# EAGLE design ADCDAC (EAGLE 5.07)
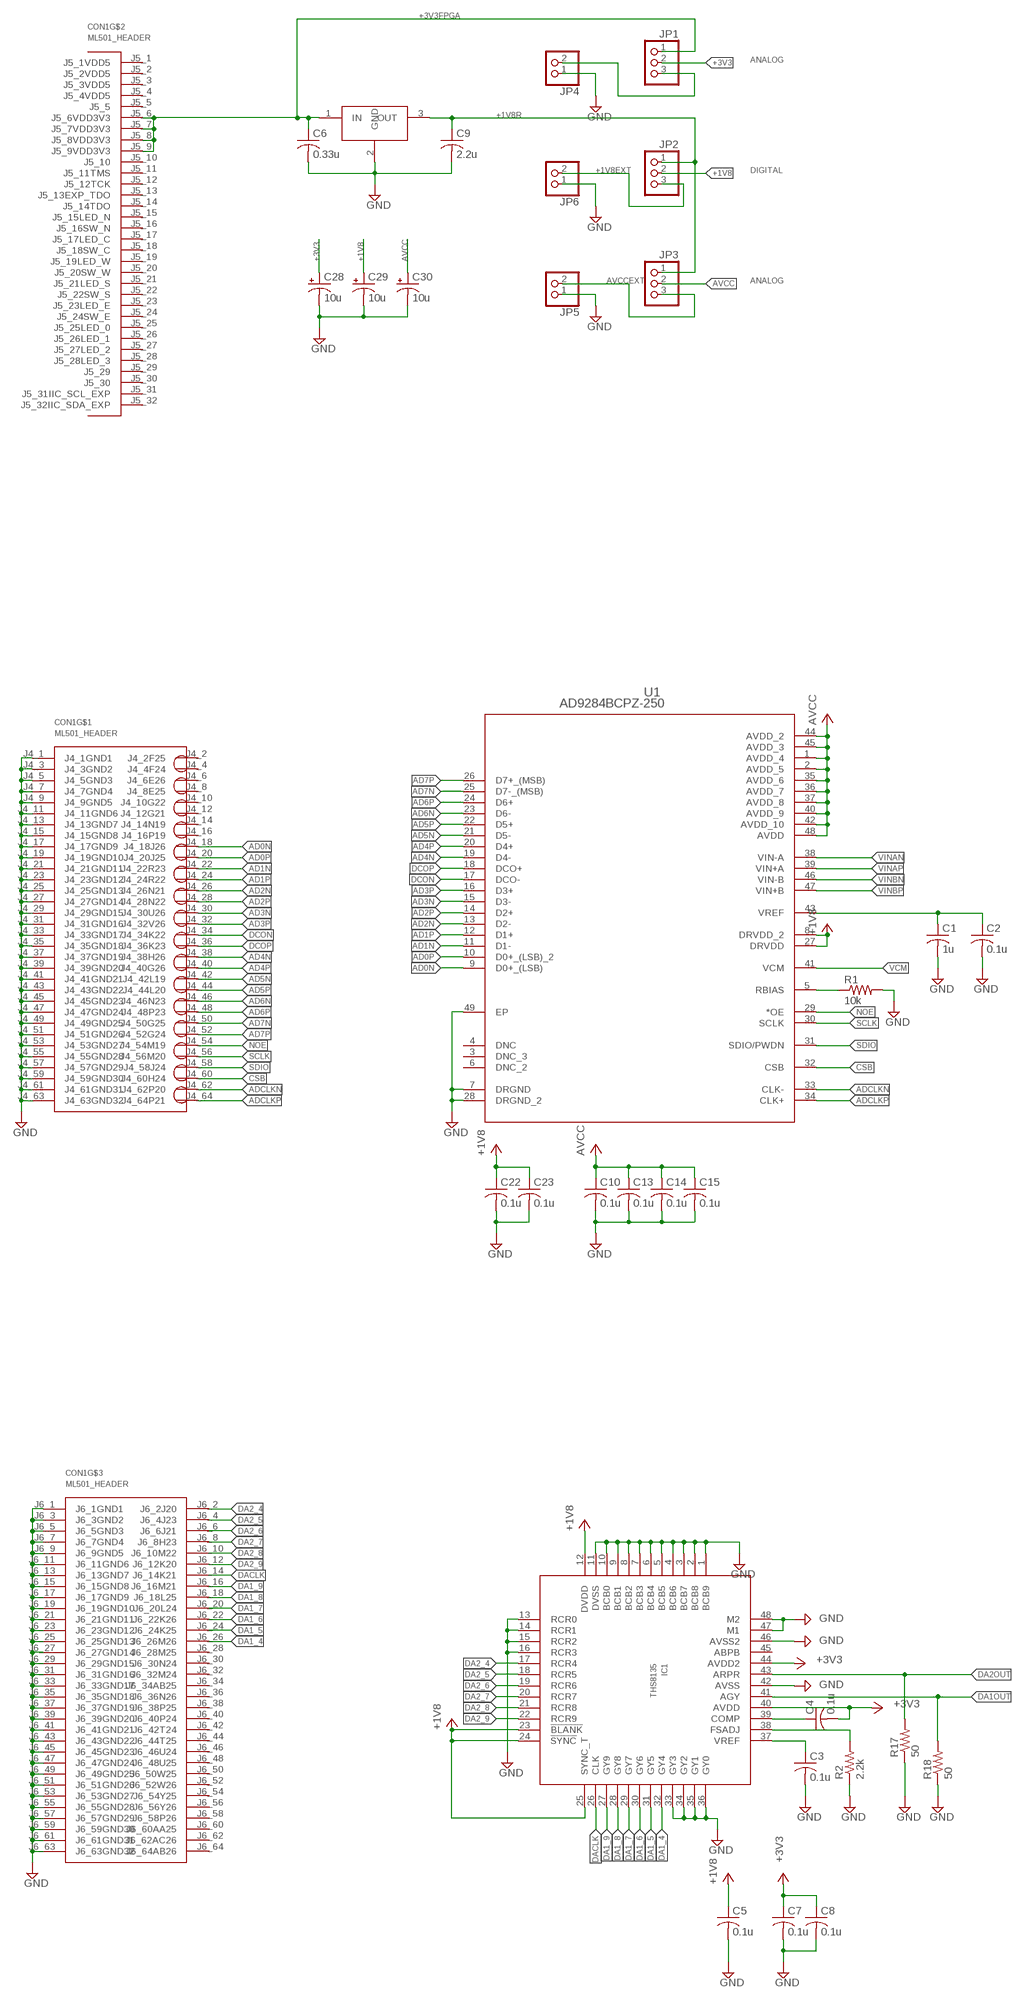
[diagram p0: schematic, sheet 1, part 1 of 2]
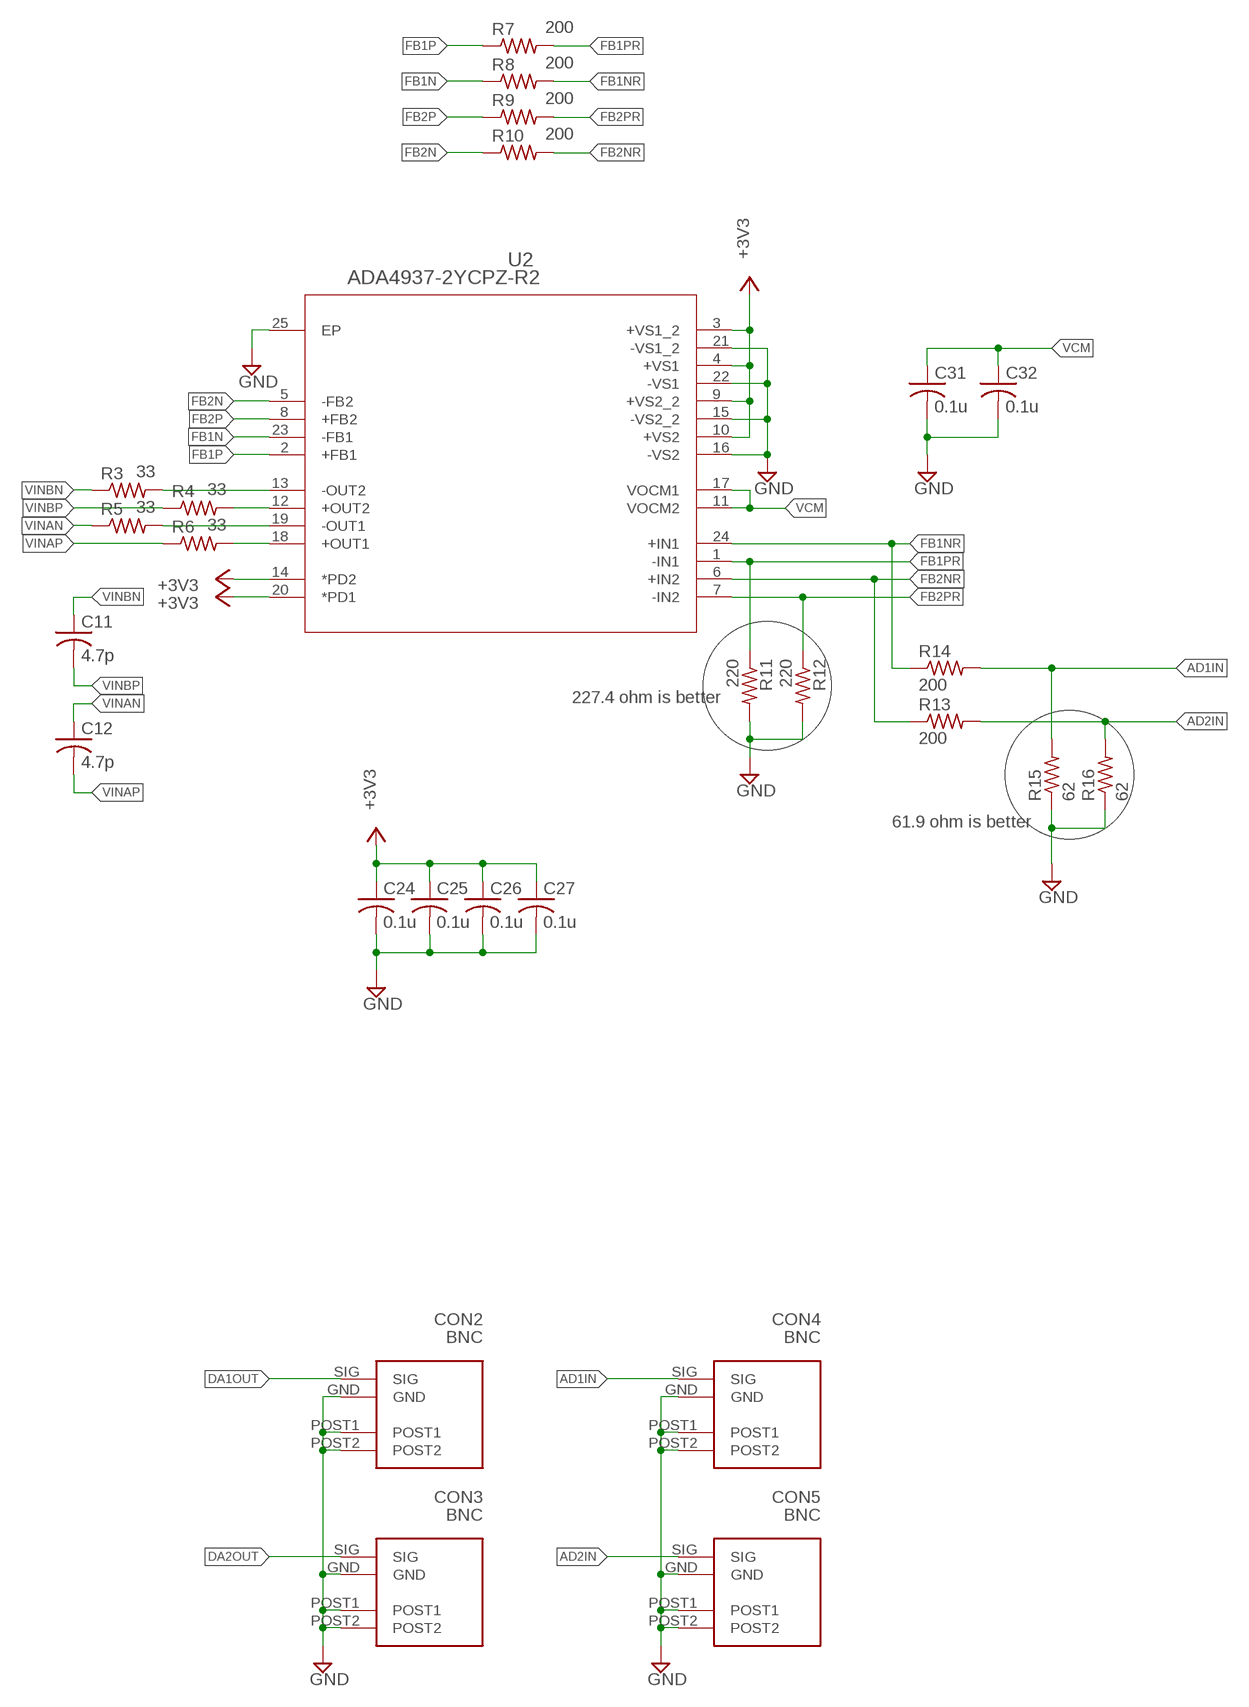
[diagram p1: schematic, sheet 1, part 2 of 2]

## Parts
C1  1u  C-3216  [3216]
C2  0.1u  C-2012  [2012-C]
C3  0.1u  C-2012  [2012-C]
C4  0.1u  C-2012  [2012-C]
C5  0.1u  C-2012  [2012-C]
C6  0.33u  C-2012  [2012-C]
C7  0.1u  C-2012  [2012-C]
C8  0.1u  C-2012  [2012-C]
C9  2.2u  C-3216  [3216]
C10  0.1u  C-2012  [2012-C]
C11  4.7p  C-1608  [1608]
C12  4.7p  C-1608  [1608]
C13  0.1u  C-2012  [2012-C]
C14  0.1u  C-2012  [2012-C]
C15  0.1u  C-2012  [2012-C]
C22  0.1u  C-2012  [2012-C]
C23  0.1u  C-2012  [2012-C]
C24  0.1u  C-2012  [2012-C]
C25  0.1u  C-2012  [2012-C]
C26  0.1u  C-2012  [2012-C]
C27  0.1u  C-2012  [2012-C]
C28  10u  CC-5-5  [E5-5]
C29  10u  CC-5-5  [E5-5]
C30  10u  CC-5-5  [E5-5]
C31  0.1u  C-2012  [2012-C]
C32  0.1u  C-2012  [2012-C]
CON1  ML501_HEADER  [ML501_HEADER]
CON2  BNC  [BNC1-1337542-0]
CON3  BNC  [BNC1-1337542-0]
CON4  BNC  [BNC1-1337542-0]
CON5  BNC  [BNC1-1337542-0]
IC1  THS8135  [LQFP48]
IC3  NJM2845DL1-18  [TO-252-3]
JP1  PINHD-1X3  [1X03]
JP2  PINHD-1X3  [1X03]
JP3  PINHD-1X3  [1X03]
JP4  PINHD-1X2  [1X02]
JP5  PINHD-1X2  [1X02]
JP6  PINHD-1X2  [1X02]
R1  10k  R-1608  [1608]
R2  2.2k  R-1608  [1608]
R3  33  R-1608  [1608]
R4  33  R-1608  [1608]
R5  33  R-1608  [1608]
R6  33  R-1608  [1608]
R7  200  R-1608  [1608]
R8  200  R-1608  [1608]
R9  200  R-1608  [1608]
R10  200  R-1608  [1608]
R11  220  R-1608  [1608]
R12  220  R-1608  [1608]
R13  200  R-1608  [1608]
R14  200  R-1608  [1608]
R15  62  R-1608  [1608]
R16  62  R-1608  [1608]
R17  50  R-1608  [1608]
R18  50  R-1608  [1608]
U1  AD9284BCPZ-250  [CP_48_12]
U2  ADA4937-2YCPZ-R2  [CP_24_1]

## Nets
+1V8: C5.1 C22.1 C23.1 C29.+ IC1.12(DVDD) IC1.23(!BLANK) IC1.24(!SYNC) IC1.25(SYNC_T) JP2.2 U1.8(DRVDD_2) U1.27(DRVDD)
+1V8EXT: JP2.3 JP6.2
+1V8R: C9.1 IC3.3(OUT) JP2.1 JP3.1
+3V3: C4.2 C7.1 C8.1 C24.1 C25.1 C26.1 C27.1 C28.+ IC1.40(AVDD) IC1.44(AVDD2) JP1.2 U2.3(+VS1_2) U2.4(+VS1) U2.9(+VS2_2) U2.10(+VS2) U2.14(*PD2) U2.20(*PD1)
+3V3FPGA: C6.1 CON1.J5_6(J5_6VDD3V3) CON1.J5_7(J5_7VDD3V3) CON1.J5_8(J5_8VDD3V3) CON1.J5_9(J5_9VDD3V3) IC3.1(IN) JP1.1
AD0N: CON1.J4_18(J4_18J26) U1.9(D0+_(LSB))
AD0P: CON1.J4_20(J4_20J25) U1.10(D0+_(LSB)_2)
AD1IN: CON4.SIG R14.2 R15.2
AD1N: CON1.J4_22(J4_22R23) U1.11(D1-)
AD1P: CON1.J4_24(J4_24R22) U1.12(D1+)
AD2IN: CON5.SIG R13.2 R16.2
AD2N: CON1.J4_26(J4_26N21) U1.13(D2-)
AD2P: CON1.J4_28(J4_28N22) U1.14(D2+)
AD3N: CON1.J4_30(J4_30U26) U1.15(D3-)
AD3P: CON1.J4_32(J4_32V26) U1.16(D3+)
AD4N: CON1.J4_38(J4_38H26) U1.19(D4-)
AD4P: CON1.J4_40(J4_40G26) U1.20(D4+)
AD5N: CON1.J4_42(J4_42L19) U1.21(D5-)
AD5P: CON1.J4_44(J4_44L20) U1.22(D5+)
AD6N: CON1.J4_46(J4_46N23) U1.23(D6-)
AD6P: CON1.J4_48(J4_48P23) U1.24(D6+)
AD7N: CON1.J4_50(J4_50G25) U1.25(D7-_(MSB))
AD7P: CON1.J4_52(J4_52G24) U1.26(D7+_(MSB))
ADCLKN: CON1.J4_62(J4_62P20) U1.33(CLK-)
ADCLKP: CON1.J4_64(J4_64P21) U1.34(CLK+)
AVCC: C10.1 C13.1 C14.1 C15.1 C30.+ JP3.2 U1.1(AVDD_4) U1.2(AVDD_5) U1.35(AVDD_6) U1.36(AVDD_7) U1.37(AVDD_8) U1.40(AVDD_9) U1.42(AVDD_10) U1.44(AVDD_2) U1.45(AVDD_3) U1.48(AVDD)
AVCCEXT: JP3.3 JP5.2
CSB: CON1.J4_60(J4_60H24) U1.32(CSB)
DA1_4: CON1.J6_26(J6_26M26) IC1.32(GY4)
DA1_5: CON1.J6_24(J6_24K25) IC1.31(GY5)
DA1_6: CON1.J6_22(J6_22K26) IC1.30(GY6)
DA1_7: CON1.J6_20(J6_20L24) IC1.29(GY7)
DA1_8: CON1.J6_18(J6_18L25) IC1.28(GY8)
DA1_9: CON1.J6_16(J6_16M21) IC1.27(GY9)
DA1OUT: CON2.SIG IC1.41(AGY) R18.2
DA2_4: CON1.J6_2(J6_2J20) IC1.17(RCR4)
DA2_5: CON1.J6_4(J6_4J23) IC1.18(RCR5)
DA2_6: CON1.J6_6(J6_6J21) IC1.19(RCR6)
DA2_7: CON1.J6_8(J6_8H23) IC1.20(RCR7)
DA2_8: CON1.J6_10(J6_10M22) IC1.21(RCR8)
DA2_9: CON1.J6_12(J6_12K20) IC1.22(RCR9)
DA2OUT: CON3.SIG IC1.43(ARPR) R17.2
DACLK: CON1.J6_14(J6_14K21) IC1.26(CLK)
DCON: CON1.J4_34(J4_34K22) U1.17(DCO-)
DCOP: CON1.J4_36(J4_36K23) U1.18(DCO+)
FB1N: R8.1 U2.23(-FB1)
FB1NR: R8.2 R14.1 U2.24(+IN1)
FB1P: R7.1 U2.2(+FB1)
FB1PR: R7.2 R11.1 U2.1(-IN1)
FB2N: R10.1 U2.5(-FB2)
FB2NR: R10.2 R13.1 U2.6(+IN2)
FB2P: R9.1 U2.8(+FB2)
FB2PR: R9.2 R12.1 U2.7(-IN2)
GND: C1.2 C2.2 C3.2 C5.2 C6.2 C7.2 C8.2 C9.2 C10.2 C13.2 C14.2 C15.2 C22.2 C23.2 C24.2 C25.2 C26.2 C27.2 C28.- C29.- C30.- C31.2 C32.2 CON1.J4_1(J4_1GND1) CON1.J4_3(J4_3GND2) CON1.J4_5(J4_5GND3) CON1.J4_7(J4_7GND4) CON1.J4_9(J4_9GND5) CON1.J4_11(J4_11GND6) CON1.J4_13(J4_13GND7) CON1.J4_15(J4_15GND8) CON1.J4_17(J4_17GND9) CON1.J4_19(J4_19GND10) CON1.J4_21(J4_21GND11) CON1.J4_23(J4_23GND12) CON1.J4_25(J4_25GND13) CON1.J4_27(J4_27GND14) CON1.J4_29(J4_29GND15) CON1.J4_31(J4_31GND16) CON1.J4_33(J4_33GND17) CON1.J4_35(J4_35GND18) CON1.J4_37(J4_37GND19) CON1.J4_39(J4_39GND20) CON1.J4_41(J4_41GND21) CON1.J4_43(J4_43GND22) CON1.J4_45(J4_45GND23) CON1.J4_47(J4_47GND24) CON1.J4_49(J4_49GND25) CON1.J4_51(J4_51GND26) CON1.J4_53(J4_53GND27) CON1.J4_55(J4_55GND28) CON1.J4_57(J4_57GND29) CON1.J4_59(J4_59GND30) CON1.J4_61(J4_61GND31) CON1.J4_63(J4_63GND32) CON1.J6_1(J6_1GND1) CON1.J6_3(J6_3GND2) CON1.J6_5(J6_5GND3) CON1.J6_7(J6_7GND4) CON1.J6_9(J6_9GND5) CON1.J6_11(J6_11GND6) CON1.J6_13(J6_13GND7) CON1.J6_15(J6_15GND8) CON1.J6_17(J6_17GND9) CON1.J6_19(J6_19GND10) CON1.J6_21(J6_21GND11) CON1.J6_23(J6_23GND12) CON1.J6_25(J6_25GND13) CON1.J6_27(J6_27GND14) CON1.J6_29(J6_29GND15) CON1.J6_31(J6_31GND16) CON1.J6_33(J6_33GND17) CON1.J6_35(J6_35GND18) CON1.J6_37(J6_37GND19) CON1.J6_39(J6_39GND20) CON1.J6_41(J6_41GND21) CON1.J6_43(J6_43GND22) CON1.J6_45(J6_45GND23) CON1.J6_47(J6_47GND24) CON1.J6_49(J6_49GND25) CON1.J6_51(J6_51GND26) CON1.J6_53(J6_53GND27) CON1.J6_55(J6_55GND28) CON1.J6_57(J6_57GND29) CON1.J6_59(J6_59GND30) CON1.J6_61(J6_61GND31) CON1.J6_63(J6_63GND32) CON2.GND CON2.POST1 CON2.POST2 CON3.GND CON3.POST1 CON3.POST2 CON4.GND CON4.POST1 CON4.POST2 CON5.GND CON5.POST1 CON5.POST2 IC1.1(BCB9) IC1.2(BCB8) IC1.3(BCB7) IC1.4(BCB6) IC1.5(BCB5) IC1.6(BCB4) IC1.7(BCB3) IC1.8(BCB2) IC1.9(BCB1) IC1.10(BCB0) IC1.11(DVSS) IC1.13(RCR0) IC1.14(RCR1) IC1.15(RCR2) IC1.16(RCR3) IC1.33(GY3) IC1.34(GY2) IC1.35(GY1) IC1.36(GY0) IC1.42(AVSS) IC1.46(AVSS2) IC1.47(M1) IC1.48(M2) IC3.2(GND) JP4.1 JP5.1 JP6.1 R1.2 R2.1 R11.2 R12.2 R15.1 R16.1 R17.1 R18.1 U1.7(DRGND) U1.28(DRGND_2) U1.49(EP) U2.15(-VS2_2) U2.16(-VS2) U2.21(-VS1_2) U2.22(-VS1) U2.25(EP)
N$1: R1.1 U1.5(RBIAS)
N$2: C1.1 C2.1 U1.43(VREF)
N$3: C3.1 IC1.37(VREF)
N$4: IC1.38(FSADJ) R2.2
N$5: C4.1 IC1.39(COMP)
N$6: R3.2 U2.13(-OUT2)
N$8: JP1.3 JP4.2
N$9: R4.2 U2.12(+OUT2)
N$10: R5.2 U2.19(-OUT1)
N$11: R6.2 U2.18(+OUT1)
NOE: CON1.J4_54(J4_54M19) U1.29(*OE)
SCLK: CON1.J4_56(J4_56M20) U1.30(SCLK)
SDIO: CON1.J4_58(J4_58J24) U1.31(SDIO/PWDN)
VCM: C31.1 C32.1 U1.41(VCM) U2.11(VOCM2) U2.17(VOCM1)
VINAN: C12.1 R5.1 U1.38(VIN-A)
VINAP: C12.2 R6.1 U1.39(VIN+A)
VINBN: C11.1 R3.1 U1.46(VIN-B)
VINBP: C11.2 R4.1 U1.47(VIN+B)
Unconnected: CON1.J4_2(J4_2F25) CON1.J4_4(J4_4F24) CON1.J4_6(J4_6E26) CON1.J4_8(J4_8E25) CON1.J4_10(J4_10G22) CON1.J4_12(J4_12G21) CON1.J4_14(J4_14N19) CON1.J4_16(J4_16P19) CON1.J5_1(J5_1VDD5) CON1.J5_2(J5_2VDD5) CON1.J5_3(J5_3VDD5) CON1.J5_4(J5_4VDD5) CON1.J5_5 CON1.J5_10 CON1.J5_11(J5_11TMS) CON1.J5_12(J5_12TCK) CON1.J5_13(J5_13EXP_TDO) CON1.J5_14(J5_14TDO) CON1.J5_15(J5_15LED_N) CON1.J5_16(J5_16SW_N) CON1.J5_17(J5_17LED_C) CON1.J5_18(J5_18SW_C) CON1.J5_19(J5_19LED_W) CON1.J5_20(J5_20SW_W) CON1.J5_21(J5_21LED_S) CON1.J5_22(J5_22SW_S) CON1.J5_23(J5_23LED_E) CON1.J5_24(J5_24SW_E) CON1.J5_25(J5_25LED_0) CON1.J5_26(J5_26LED_1) CON1.J5_27(J5_27LED_2) CON1.J5_28(J5_28LED_3) CON1.J5_29 CON1.J5_30 CON1.J5_31(J5_31IIC_SCL_EXP) CON1.J5_32(J5_32IIC_SDA_EXP) CON1.J6_28(J6_28M25) CON1.J6_30(J6_30N24) CON1.J6_32(J6_32M24) CON1.J6_34(J6_34AB25) CON1.J6_36(J6_36N26) CON1.J6_38(J6_38P25) CON1.J6_40(J6_40P24) CON1.J6_42(J6_42T24) CON1.J6_44(J6_44T25) CON1.J6_46(J6_46U24) CON1.J6_48(J6_48U25) CON1.J6_50(J6_50W25) CON1.J6_52(J6_52W26) CON1.J6_54(J6_54Y25) CON1.J6_56(J6_56Y26) CON1.J6_58(J6_58P26) CON1.J6_60(J6_60AA25) CON1.J6_62(J6_62AC26) CON1.J6_64(J6_64AB26) CON1.J7_1(J7_1VDD2V5) CON1.J7_2(J7_2VDD2V5) CON1.J7_3(J7_3VDD2V5) CON1.J7_4(J7_4VDD2V5) CON1.J7_5(J7_5VDD2V5) CON1.J7_6(J7_6VDD2V5) CON1.J7_7(J7_7VDD2V5) CON1.J7_8(J7_8VDD2V5) CON1.J7_9(J7_9VDD2V5) CON1.J7_10(J7_10VDD2V5) CON1.J7_11(J7_11VDD2V5) CON1.J7_12(J7_12VDD2V5) CON1.J7_13(J7_13VDD2V5) CON1.J7_14(J7_14VDD2V5) CON1.J7_15(J7_15VDD2V5) CON1.J7_16(J7_16VDD2V5) CON1.J7_17(J7_17VDD2V5) CON1.J7_18(J7_18VDD2V5) CON1.J7_19(J7_19VDD2V5) CON1.J7_20(J7_20VDD2V5) CON1.J7_21(J7_21VDD2V5) CON1.J7_22(J7_22VDD2V5) CON1.J7_23(J7_23VDD2V5) CON1.J7_24(J7_24VDD2V5) CON1.J7_25(J7_25VDD2V5) CON1.J7_26(J7_26VDD2V5) CON1.J7_27(J7_27VDD2V5) CON1.J7_28(J7_28VDD2V5) CON1.J7_29(J7_29VDD2V5) CON1.J7_30(J7_30VDD2V5) CON1.J7_31(J7_31VDD2V5) CON1.J7_32(J7_32VDD2V5) IC1.45(ABPB) U1.3(DNC_3) U1.4(DNC) U1.6(DNC_2)

## Notes on the sheet
- ANALOG
- DIGITAL
- ANALOG
- 227.4 ohm is better
- 61.9 ohm is better

## Library data of the parts
C1-C15 C22-C27 C31 C32 = Passive_Robotech:C
C28-C30 = Passive_Robotech:CC
CON1 = vdec:ML501_HEADER
CON2-CON5 = vdec:BNC
IC1 = vdec:THS8135
IC3 = IC_Robotech:NJM2845DL1-*
JP1-JP3 = pinhead:PINHD-1X3: PIN HEADER
JP4-JP6 = pinhead:PINHD-1X2: PIN HEADER
R1-R18 = Passive_Robotech:R
U1 = vdec:AD9284BCPZ-250
U2 = vdec:ADA4937-2YCPZ-R2

## Board
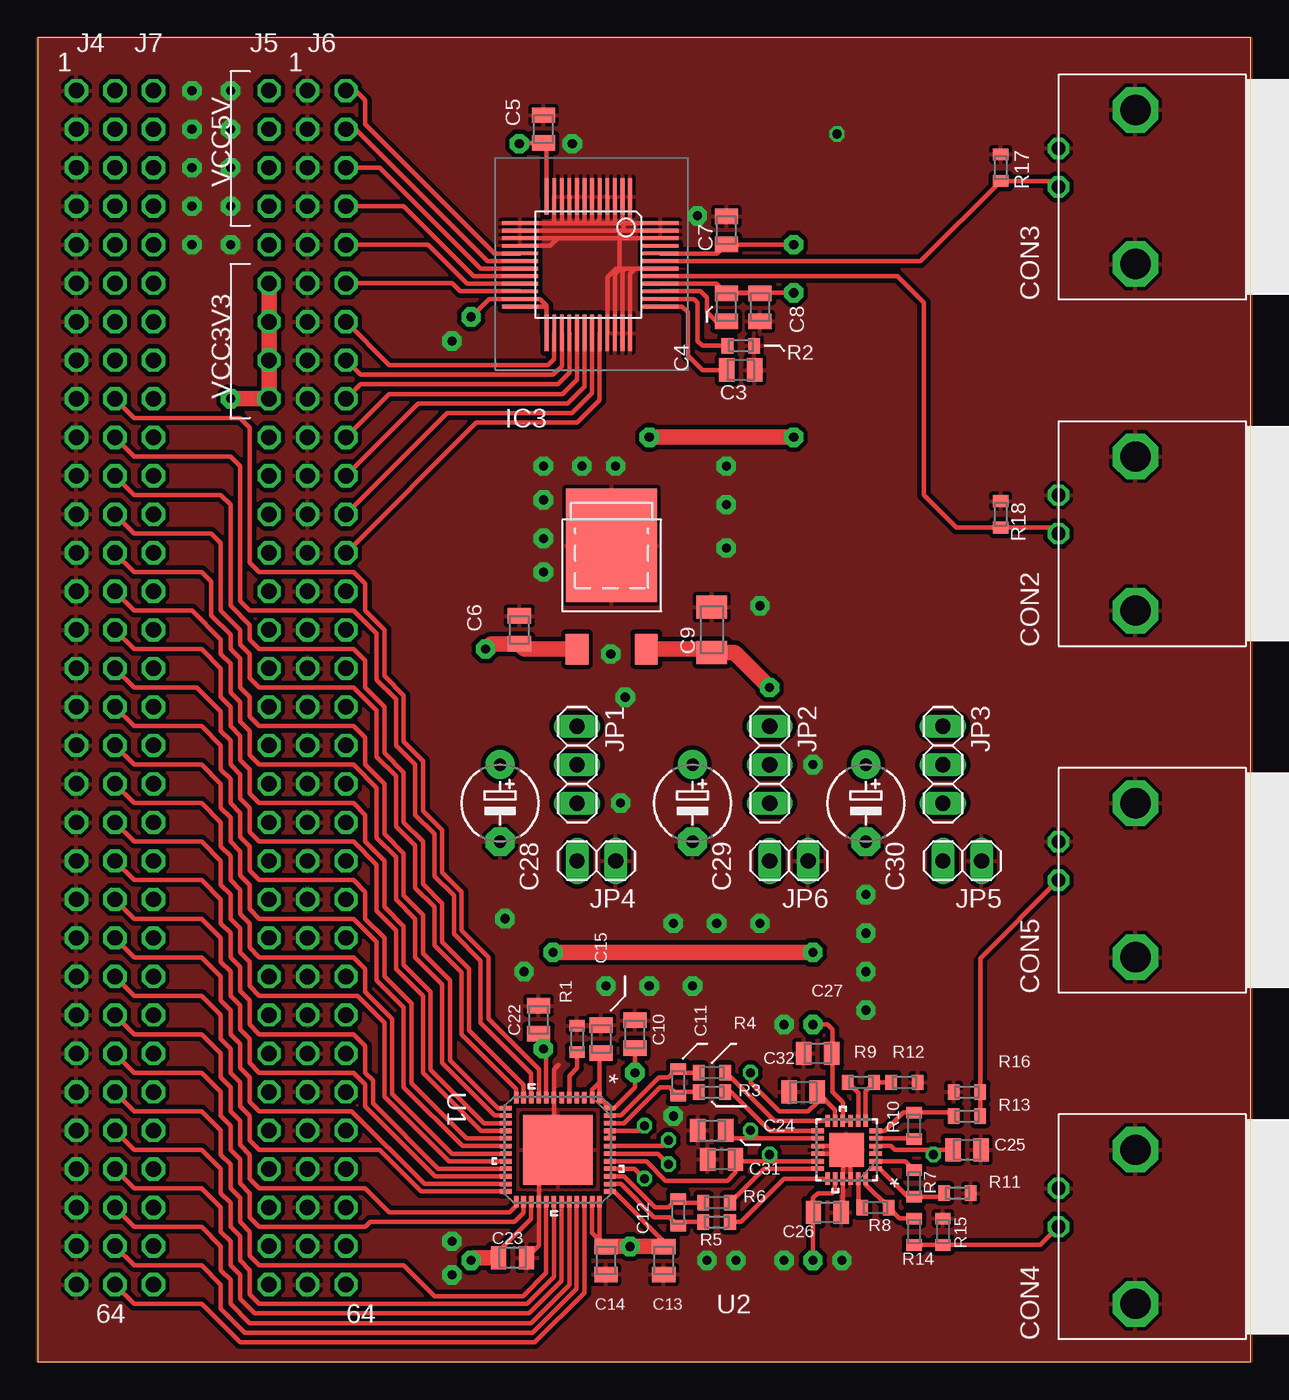
[diagram p2: board, top side]
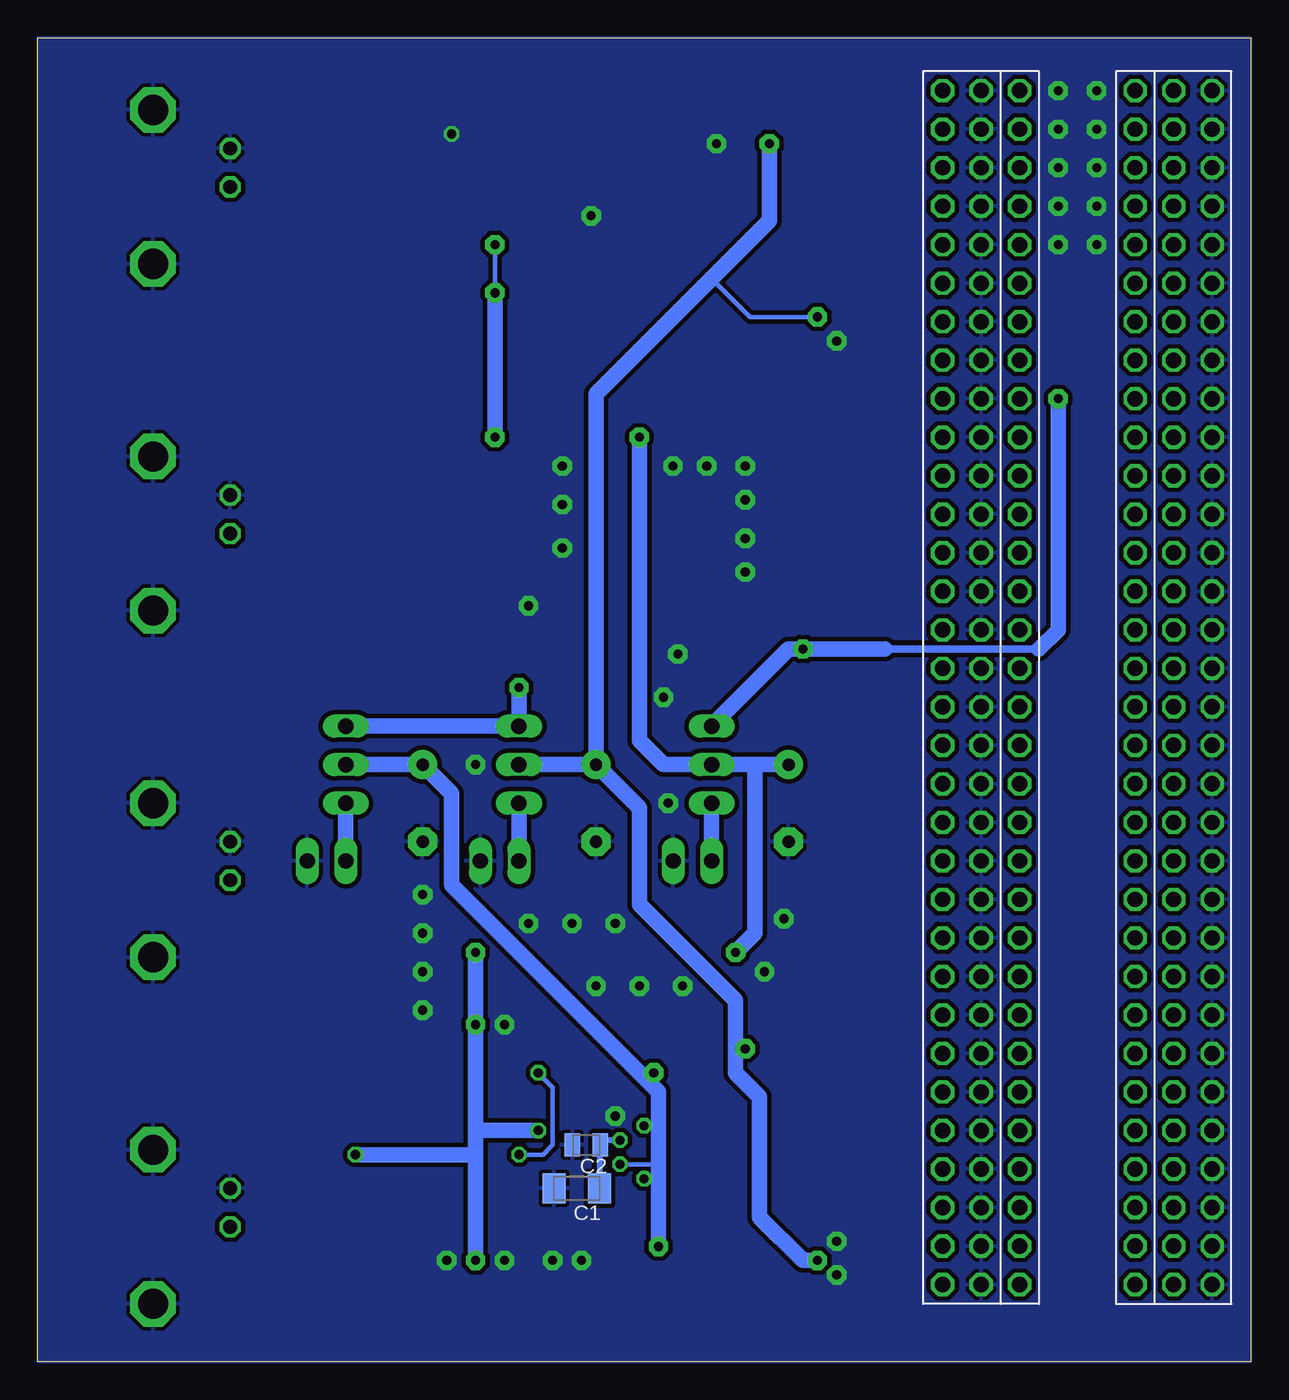
[diagram p3: board, bottom side, seen from below]

Size 79.99 x 87.3 mm. Coordinates in mm from the lower left corner, seen from the top.
Outline: 0,0 79.99,0 79.99,87.3 0,87.3 0,0
Copper layers (1*16): Top 0.0356mm / dielectric 1.5011mm / Bottom 0.0356mm
Design rules "formitaminimum": minimum track width 5mil, minimum drill 0.5994mm, track to track 0.2007mm, track to pad 0.2007mm, pad to pad 0.2007mm, via to via 0.2007mm, smd to smd 0mil, copper to edge 0mil, drill to drill 1mil, minimum pad ring 10mil, minimum via ring 8mil, stop-mask expansion 4mil, vias tented up to drill 0mil, thermal gap 10mil

### Footprints (pad centres in the part's own frame; a part is rotated, then mirrored left to right if it is on the bottom)
3216 = smd 1.5 x 2: 1 -1.5,0; 2 1.5,0
2012-C = smd 1.016 x 1.524: 1 -0.921,0; 2 0.921,0
1608 = smd 0.762 x 1.016: 1 -0.875,0; 2 0.875,0
E5-5 = drill 0.813 pad 1.905 round: + -2.54,0 | drill 0.813 pad 1.905 octagon: - 2.54,0
ML501_HEADER = drill 1.016 octagon: J4_1 -8.89,39.37; J4_2 -6.35,39.37; J4_3 -8.89,36.83; J4_4 -6.35,36.83; J4_5 -8.89,34.29; J4_6 -6.35,34.29; J4_7 -8.89,31.75; J4_8 -6.35,31.75; J4_9 -8.89,29.21; J4_10 -6.35,29.21; J4_11 -8.89,26.67; J4_12 -6.35,26.67; J4_13 -8.89,24.13; J4_14 -6.35,24.13; J4_15 -8.89,21.59; J4_16 -6.35,21.59; J4_17 -8.89,19.05; J4_18 -6.35,19.05; J4_19 -8.89,16.51; J4_20 -6.35,16.51; J4_21 -8.89,13.97; J4_22 -6.35,13.97; J4_23 -8.89,11.43; J4_24 -6.35,11.43; J4_25 -8.89,8.89; J4_26 -6.35,8.89; J4_27 -8.89,6.35; J4_28 -6.35,6.35; J4_29 -8.89,3.81; J4_30 -6.35,3.81; J4_31 -8.89,1.27; J4_32 -6.35,1.27; J4_33 -8.89,-1.27; J4_34 -6.35,-1.27; J4_35 -8.89,-3.81; J4_36 -6.35,-3.81; J4_37 -8.89,-6.35; J4_38 -6.35,-6.35; J4_39 -8.89,-8.89; J4_40 -6.35,-8.89; J4_41 -8.89,-11.43; J4_42 -6.35,-11.43; J4_43 -8.89,-13.97; J4_44 -6.35,-13.97; J4_45 -8.89,-16.51; J4_46 -6.35,-16.51; J4_47 -8.89,-19.05; J4_48 -6.35,-19.05; J4_49 -8.89,-21.59; J4_50 -6.35,-21.59; J4_51 -8.89,-24.13; J4_52 -6.35,-24.13; J4_53 -8.89,-26.67; J4_54 -6.35,-26.67; J4_55 -8.89,-29.21; J4_56 -6.35,-29.21; J4_57 -8.89,-31.75; J4_58 -6.35,-31.75; J4_59 -8.89,-34.29; J4_60 -6.35,-34.29; J4_61 -8.89,-36.83; J4_62 -6.35,-36.83; J4_63 -8.89,-39.37; J4_64 -6.35,-39.37; J5_1 3.81,39.37; J5_2 3.81,36.83; J5_3 3.81,34.29; J5_4 3.81,31.75; J5_5 3.81,29.21; J5_6 3.81,26.67; J5_7 3.81,24.13; J5_8 3.81,21.59; J5_9 3.81,19.05; J5_10 3.81,16.51; J5_11 3.81,13.97; J5_12 3.81,11.43; J5_13 3.81,8.89; J5_14 3.81,6.35; J5_15 3.81,3.81; J5_16 3.81,1.27; J5_17 3.81,-1.27; J5_18 3.81,-3.81; J5_19 3.81,-6.35; J5_20 3.81,-8.89; J5_21 3.81,-11.43; J5_22 3.81,-13.97; J5_23 3.81,-16.51; J5_24 3.81,-19.05; J5_25 3.81,-21.59; J5_26 3.81,-24.13; J5_27 3.81,-26.67; J5_28 3.81,-29.21; J5_29 3.81,-31.75; J5_30 3.81,-34.29; J5_31 3.81,-36.83; J5_32 3.81,-39.37; J6_1 6.35,39.37; J6_2 8.89,39.37; J6_3 6.35,36.83; J6_4 8.89,36.83; J6_5 6.35,34.29; J6_6 8.89,34.29; J6_7 6.35,31.75; J6_8 8.89,31.75; J6_9 6.35,29.21; J6_10 8.89,29.21; J6_11 6.35,26.67; J6_12 8.89,26.67; J6_13 6.35,24.13; J6_14 8.89,24.13; J6_15 6.35,21.59; J6_16 8.89,21.59; J6_17 6.35,19.05; J6_18 8.89,19.05; J6_19 6.35,16.51; J6_20 8.89,16.51; J6_21 6.35,13.97; J6_22 8.89,13.97; J6_23 6.35,11.43; J6_24 8.89,11.43; J6_25 6.35,8.89; J6_26 8.89,8.89; J6_27 6.35,6.35; J6_28 8.89,6.35; J6_29 6.35,3.81; J6_30 8.89,3.81; J6_31 6.35,1.27; J6_32 8.89,1.27; J6_33 6.35,-1.27; J6_34 8.89,-1.27; J6_35 6.35,-3.81; J6_36 8.89,-3.81; J6_37 6.35,-6.35; J6_38 8.89,-6.35; J6_39 6.35,-8.89; J6_40 8.89,-8.89; J6_41 6.35,-11.43; J6_42 8.89,-11.43; J6_43 6.35,-13.97; J6_44 8.89,-13.97; J6_45 6.35,-16.51; J6_46 8.89,-16.51; J6_47 6.35,-19.05; J6_48 8.89,-19.05; J6_49 6.35,-21.59; J6_50 8.89,-21.59; J6_51 6.35,-24.13; J6_52 8.89,-24.13; J6_53 6.35,-26.67; J6_54 8.89,-26.67; J6_55 6.35,-29.21; J6_56 8.89,-29.21; J6_57 6.35,-31.75; J6_58 8.89,-31.75; J6_59 6.35,-34.29; J6_60 8.89,-34.29; J6_61 6.35,-36.83; J6_62 8.89,-36.83; J6_63 6.35,-39.37; J6_64 8.89,-39.37; J7_1 -3.81,39.37; J7_2 -3.81,36.83; J7_3 -3.81,34.29; J7_4 -3.81,31.75; J7_5 -3.81,29.21; J7_6 -3.81,26.67; J7_7 -3.81,24.13; J7_8 -3.81,21.59; J7_9 -3.81,19.05; J7_10 -3.81,16.51; J7_11 -3.81,13.97; J7_12 -3.81,11.43; J7_13 -3.81,8.89; J7_14 -3.81,6.35; J7_15 -3.81,3.81; J7_16 -3.81,1.27; J7_17 -3.81,-1.27; J7_18 -3.81,-3.81; J7_19 -3.81,-6.35; J7_20 -3.81,-8.89; J7_21 -3.81,-11.43; J7_22 -3.81,-13.97; J7_23 -3.81,-16.51; J7_24 -3.81,-19.05; J7_25 -3.81,-21.59; J7_26 -3.81,-24.13; J7_27 -3.81,-26.67; J7_28 -3.81,-29.21; J7_29 -3.81,-31.75; J7_30 -3.81,-34.29; J7_31 -3.81,-36.83; J7_32 -3.81,-39.37
BNC1-1337542-0 = drill 0.9 octagon: GND -2.54,-5.08; SIG 0,-5.08 | drill 2 octagon: POST1 -5.08,0; POST2 5.08,0
LQFP48 = smd 0.25 x 2.4: 1 0,0; 2 0.5,0; 3 1,0; 4 1.5,0; 5 2,0; 6 2.5,0; 7 3,0; 8 3.5,0; 9 4,0; 10 4.5,0; 11 5,0; 12 5.5,0; 25 5.5,9; 26 5,9; 27 4.5,9; 28 4,9; 29 3.5,9; 30 3,9; 31 2.5,9; 32 2,9; 33 1.5,9; 34 1,9; 35 0.5,9; 36 0,9 | smd 2.4 x 0.25: 13 7.25,1.75; 14 7.25,2.25; 15 7.25,2.75; 16 7.25,3.25; 17 7.25,3.75; 18 7.25,4.25; 19 7.25,4.75; 20 7.25,5.25; 21 7.25,5.75; 22 7.25,6.25; 23 7.25,6.75; 24 7.25,7.25; 37 -2,7.25; 38 -2,6.75; 39 -2,6.25; 40 -2,5.75; 41 -2,5.25; 42 -2,4.75; 43 -2,4.25; 44 -2,3.75; 45 -2,3.25; 46 -2,2.75; 47 -2,2.25; 48 -2,1.75
TO-252-3 = smd 1.5 x 2: 1 0,0; 3 4.56,0 | smd 6 x 7.5: 2 2.28,6.84
1X03 = drill 1.016 long: 1 -2.54,0; 2 0,0; 3 2.54,0
1X02 = drill 1.016 long: 1 -1.27,0; 2 1.27,0
CP_48_12 = smd 0.762 x 0.305: 1 -3.429,2.743; 2 -3.429,2.261; 3 -3.429,1.753; 4 -3.429,1.245; 5 -3.429,0.762; 6 -3.429,0.254; 7 -3.429,-0.254; 8 -3.429,-0.762; 9 -3.429,-1.245; 10 -3.429,-1.753; 11 -3.429,-2.261; 12 -3.429,-2.743; 25 3.429,-2.743; 26 3.429,-2.261; 27 3.429,-1.753; 28 3.429,-1.245; 29 3.429,-0.762; 30 3.429,-0.254; 31 3.429,0.254; 32 3.429,0.762; 33 3.429,1.245; 34 3.429,1.753; 35 3.429,2.261; 36 3.429,2.743 | smd 0.305 x 0.762: 13 -2.743,-3.429; 14 -2.261,-3.429; 15 -1.753,-3.429; 16 -1.245,-3.429; 17 -0.762,-3.429; 18 -0.254,-3.429; 19 0.254,-3.429; 20 0.762,-3.429; 21 1.245,-3.429; 22 1.753,-3.429; 23 2.261,-3.429; 24 2.743,-3.429; 37 2.743,3.429; 38 2.261,3.429; 39 1.753,3.429; 40 1.245,3.429; 41 0.762,3.429; 42 0.254,3.429; 43 -0.254,3.429; 44 -0.762,3.429; 45 -1.245,3.429; 46 -1.753,3.429; 47 -2.261,3.429; 48 -2.743,3.429 | smd 4.597 x 4.597: 49 0,0
CP_24_1 = smd 0.813 x 0.305: 1 -1.905,1.245; 2 -1.905,0.762; 3 -1.905,0.254; 4 -1.905,-0.254; 5 -1.905,-0.762; 6 -1.905,-1.245; 13 1.905,-1.245; 14 1.905,-0.762; 15 1.905,-0.254; 16 1.905,0.254; 17 1.905,0.762; 18 1.905,1.245 | smd 0.305 x 0.813: 7 -1.245,-1.905; 8 -0.762,-1.905; 9 -0.254,-1.905; 10 0.254,-1.905; 11 0.762,-1.905; 12 1.245,-1.905; 19 1.245,1.905; 20 0.762,1.905; 21 0.254,1.905; 22 -0.254,1.905; 23 -0.762,1.905; 24 -1.245,1.905 | smd 2.261 x 2.261: 25 0,0

### Placement (x,y rotation side)
C1  44.45,11.43 180 bottom
C2  43.81,14.29 180 bottom
C3  46.35,65.41 0 top
C4  45.4,69.53 90 top
C5  33.34,81.28 90 top
C6  31.75,48.26 90 top
C7  45.4,74.61 90 top
C8  47.62,69.53 270 top
C9  44.45,48.26 90 top
C10  39.37,21.59 90 top
C11  42.23,18.41 90 top
C12  42.23,9.84 90 top
C13  41.27,6.67 270 top
C14  37.47,6.67 270 top
C15  37.15,21.27 90 top
C22  33.02,22.54 90 top
C23  31.31,6.86 0 top
C24  44.45,15.24 180 top
C25  61.28,13.97 0 top
C26  52.07,9.84 0 top
C27  51.44,20.32 180 top
C28  30.48,36.83 270 top
C29  43.18,36.83 270 top
C30  54.61,36.83 270 top
C31  45.09,13.34 180 top
C32  50.48,17.78 180 top
CON1  11.43,44.45 0 top
CON2  72.39,54.61 270 top
CON3  72.39,77.47 270 top
CON4  72.39,8.89 270 top
CON5  72.39,31.75 270 top
IC1  39.05,76.84 180 top
IC3  35.56,46.99 0 top
JP1  35.56,39.37 270 top
JP2  48.26,39.37 270 top
JP3  59.69,39.37 270 top
JP4  36.83,33.02 180 top
JP5  60.96,33.02 180 top
JP6  49.53,33.02 180 top
R1  35.56,21.27 90 top
R2  46.35,66.99 180 top
R3  44.45,17.78 0 top
R4  44.45,19.05 0 top
R5  44.77,9.21 0 top
R6  44.77,10.48 0 top
R7  57.78,11.75 270 top
R8  55.24,10.16 0 top
R9  54.29,18.41 0 top
R10  57.78,15.56 90 top
R11  60.64,11.11 0 top
R12  57.15,18.41 0 top
R13  61.28,16.19 0 top
R14  57.78,8.57 270 top
R15  59.69,8.57 270 top
R16  61.28,17.78 0 top
R17  63.5,78.74 270 top
R18  63.5,55.88 270 top
U1  34.29,13.97 270 top
U2  53.34,13.97 180 top

### Tracks (layer width: path | path; a pad name or v marks a point on that pad's centre or on a via)
+1V8  (via drill 0.6 pad 1.27)
  Top 0.305: IC1.12 33.55,80.14 C5.1 31.78,80.36 v31.75,80.33 | U1.27 32.54,9.42 30.39,7.27 C23.1 30.19,6.67 | 33.55,69.53 IC1.25 | 33.55,69.53 33.55,69.64 33.1,70.09 IC1.23 29.76,70.09 v28.57,68.9 | IC1.24 33.5,69.59 33.55,69.53 | C22.1 33.34,21.62 v33.34,20.64 33.53,20.45 U1.8
  Top 1.016: v28.57,6.67 28.77,6.86 C23.1
  Bottom 0.305: v28.57,68.9 33.02,68.9 35.56,71.44 | 33.97,20.64 v33.34,20.64
  Bottom 1.016: C29.+ JP2.2 | C29.+ 43.18,63.82 35.56,71.44 31.75,75.25 v31.75,80.33 | C29.+ 40.32,36.51 40.32,30.16 33.97,23.81 33.97,20.64 33.97,19.05 32.38,17.46 32.38,9.53 29.53,6.67 v28.57,6.67
+1V8EXT
  Bottom 1.016: JP6.2 JP2.3
+1V8R  (via drill 0.6 pad 1.27)
  Top 0.508: 44.22,46.99 C9.1
  Top 1.016: IC3.3 44.22,46.99 | C9.1 45.95,46.76 v48.26,44.45
  Bottom 1.016: v48.26,44.45 JP2.1 JP3.1
+3V3  (via drill 0.6, 0.6 pad 1.27)
  Top 0.203: C26.1 51.15,9.56 51.12,9.53
  Top 0.305: IC1.40 44.77,71.09 45.37,70.48 | 45.37,70.48 C4.2 C8.1 | C8.1 | IC1.44 44.8,73.09 C7.1 45.43,73.66 v49.85,73.66 | U2.9 U2.10 53.09,17.08 52.39,17.78 52.39,20.29 | 52.39,20.29 C27.1 | 58.74,13.97 C25.1 | U2.3 U2.4 56.26,14.22 56.52,13.97 58.74,13.97 | C24.1 45.88,14.73 U2.14 47.5,14.73 v46.99,15.24 | v49.85,70.48 45.37,70.48 | U2.20 52.58,11.3 52.39,11.11 51.44,11.11 51.12,10.8 51.12,9.53 v51.12,6.67 | 52.39,20.29 52.39,21.91 52.07,22.22 v51.12,22.22 | v59.05,13.65 58.74,13.97
  Top 1.016: v40.32,60.96 v49.85,60.96 | v51.12,26.99 v33.97,26.99
  Bottom 0.305: v49.85,70.48 v49.85,73.66
  Bottom 1.016: 32.7,39.37 C28.+ | 32.7,39.37 JP1.2 38.73,39.37 40.32,40.96 v40.32,60.96 | v49.85,60.96 v49.85,70.48 | v51.12,6.67 51.12,13.65 | 51.12,13.65 51.12,15.24 | 51.12,15.24 v51.12,22.22 v51.12,26.99 | v33.97,26.99 32.7,28.26 32.7,39.37 | 51.12,15.24 v46.99,15.24 | 51.12,13.65 v59.05,13.65
+3V3FPGA  (via drill 0.6 pad 1.27)
  Top 1.016: IC3.1 32.1,46.99 C6.1 29.88,47.34 v29.53,46.99 | CON1.J5_6 CON1.J5_7 CON1.J5_8 CON1.J5_9 v12.7,63.5
  Bottom 0.508: 13.97,46.99 24.13,46.99
  Bottom 1.016: v12.7,63.5 12.7,48.26 13.97,46.99 | JP1.1 30.48,46.99 v29.53,46.99 28.26,46.99 24.13,46.99
AD0N
  Top 0.305: CON1.J4_18 6.35,62.23 13.34,62.23 13.97,61.59 13.97,52.7 14.61,52.07 20.83,52.07 21.59,51.31 21.59,49.53 22.86,48.26 22.86,45.21 24.13,43.94 24.13,40.89 25.4,39.62 25.4,36.32 26.67,35.05 26.67,32.26 27.94,30.99 27.94,28.45 29.72,26.67 29.72,22.61 33.05,19.28 U1.9
AD0P
  Top 0.305: CON1.J4_20 6.35,59.69 12.7,59.69 13.34,59.05 13.34,50.16 13.97,49.53 20.83,49.53 22.35,48.01 22.35,44.96 23.62,43.69 23.62,40.64 24.89,39.37 24.89,36.07 26.16,34.8 26.16,32 27.43,30.73 27.43,28.19 29.21,26.42 29.21,22.35 32.54,19.02 U1.10
AD1IN
  Top 0.305: R14.2 R15.2 66.12,7.7 CON4.SIG
AD1N
  Top 0.305: CON1.J4_22 6.35,57.15 12.06,57.15 12.7,56.52 12.7,49.85 13.97,48.58 13.97,47.62 14.61,46.99 20.83,46.99 21.59,46.23 21.59,44.45 22.86,43.18 22.86,40.13 24.13,38.86 24.13,35.56 25.4,34.29 25.4,31.5 26.67,30.23 26.67,27.69 28.45,25.91 28.45,21.84 32.03,18.26 U1.11
AD1P
  Top 0.305: CON1.J4_24 6.35,54.61 11.43,54.61 12.06,53.98 12.06,49.53 13.34,48.26 13.34,47.31 13.97,46.67 13.97,45.09 14.61,44.45 20.83,44.45 22.35,42.93 22.35,39.88 23.62,38.61 23.62,35.31 24.89,34.04 24.89,31.24 26.16,29.97 26.16,27.43 27.94,25.65 27.94,21.59 31.55,17.98 U1.12
AD2IN
  Top 0.305: R13.2 R16.2 62.15,26.59 CON5.SIG
AD2N
  Top 0.305: CON1.J4_26 6.35,52.07 10.79,52.07 11.43,51.44 11.43,49.21 12.7,47.94 12.7,46.99 13.34,46.35 13.34,44.45 13.97,43.81 13.97,42.55 14.61,41.91 20.83,41.91 21.59,41.15 21.59,39.37 22.86,38.1 22.86,34.8 24.13,33.53 24.13,30.73 25.4,29.46 25.4,26.92 27.18,25.15 27.18,19.88 30.34,16.71 U1.13
AD2P
  Top 0.305: CON1.J4_28 6.35,49.53 10.16,49.53 12.06,47.62 12.06,46.67 12.7,46.04 12.7,44.13 13.34,43.5 13.34,42.23 13.97,41.59 13.97,40.01 14.61,39.37 20.83,39.37 22.35,37.85 22.35,34.54 23.62,33.27 23.62,30.48 24.89,29.21 24.89,26.67 26.67,24.89 26.67,19.68 30.12,16.23 U1.14
AD3N
  Top 0.305: CON1.J4_30 6.35,46.99 10.79,46.99 12.06,45.72 12.06,43.81 12.7,43.18 12.7,41.91 13.34,41.27 13.34,39.69 13.97,39.05 13.97,37.46 14.61,36.83 20.83,36.83 21.59,36.07 21.59,34.29 22.86,33.02 22.86,29.97 24.13,28.7 24.13,26.16 25.91,24.38 25.91,19.24 29.43,15.72 U1.15
AD3P
  Top 0.305: CON1.J4_32 6.35,44.45 10.48,44.45 12.06,42.86 12.06,41.59 12.7,40.96 12.7,39.37 13.34,38.73 13.34,37.15 13.97,36.51 13.97,34.92 14.61,34.29 20.83,34.29 22.35,32.77 22.35,29.72 23.62,28.45 23.62,25.91 25.4,24.13 25.4,19.05 29.23,15.21 U1.16
AD4N
  Top 0.305: CON1.J4_38 6.35,36.83 10.79,36.83 12.06,35.56 12.06,33.97 12.7,33.34 12.7,31.75 13.34,31.11 13.34,29.53 13.97,28.89 13.97,27.3 14.61,26.67 20.83,26.67 21.59,25.91 21.59,24.38 23.37,22.61 23.37,17.65 27.3,13.72 U1.19
AD4P
  Top 0.305: CON1.J4_40 6.35,34.29 10.79,34.29 12.06,33.02 12.06,31.43 12.7,30.8 12.7,29.21 13.34,28.57 13.34,26.99 13.97,26.35 13.97,24.77 14.61,24.13 21.08,24.13 22.86,22.35 22.86,17.46 27.11,13.21 U1.20
AD5N
  Top 0.305: CON1.J4_42 6.35,31.75 10.79,31.75 12.06,30.48 12.06,28.89 12.7,28.26 12.7,26.67 13.34,26.04 13.34,24.45 13.97,23.81 13.97,22.22 14.61,21.59 20.83,21.59 21.59,20.83 21.59,19.05 22.1,18.54 22.1,17.02 26.39,12.73 U1.21
AD5P
  Top 0.305: CON1.J4_44 6.35,29.21 10.79,29.21 12.06,27.94 12.06,26.35 12.7,25.72 12.7,24.13 13.34,23.49 13.34,21.91 13.97,21.27 13.97,19.68 14.61,19.05 20.83,19.05 21.59,18.29 21.59,16.83 26.2,12.22 U1.22
AD6N
  Top 0.305: CON1.J4_46 6.35,26.67 10.79,26.67 12.06,25.4 12.06,23.81 12.7,23.18 12.7,21.59 13.34,20.95 13.34,19.37 13.97,18.73 13.97,17.14 14.61,16.51 20.7,16.51 25.5,11.71 U1.23
AD6P
  Top 0.305: CON1.J4_48 6.35,24.13 10.79,24.13 12.06,22.86 12.06,21.27 12.7,20.64 12.7,19.05 13.34,18.41 13.34,16.83 13.97,16.19 13.97,14.61 14.61,13.97 22.54,13.97 25.29,11.23 U1.24
AD7N
  Top 0.305: CON1.J4_50 6.35,21.59 10.79,21.59 12.06,20.32 12.06,18.73 12.7,18.1 12.7,16.51 13.34,15.88 13.34,14.29 13.97,13.65 13.97,12.07 14.61,11.43 21.59,11.43 23.18,9.84 31.11,9.84 31.55,10.27 U1.25
AD7P
  Top 0.305: CON1.J4_52 6.35,19.05 10.79,19.05 12.06,17.78 12.06,16.19 12.7,15.56 12.7,13.97 13.34,13.34 13.34,11.75 13.97,11.11 13.97,9.53 14.61,8.89 21.59,8.89 21.91,9.21 31.43,9.21 32.03,9.8 U1.26
ADCLKN
  Top 0.305: CON1.J4_62 6.35,6.35 10.79,6.35 12.06,5.08 12.06,3.49 13.65,1.91 32.64,1.91 35.53,4.8 U1.33
ADCLKP
  Top 0.305: CON1.J4_64 6.35,3.81 10.79,3.81 13.34,1.27 32.77,1.27 36.04,4.55 U1.34
AVCC  (via drill 0.6, 0.6 pad 1.27)
  Top 0.305: 37.03,18.41 U1.1 U1.48 37.99,16.71 39.37,18.1 v39.37,19.05 C10.1 | 37.03,18.41 37.03,20.24 C15.1 | U1.2 36.55,17.93 37.03,18.41 | U1.35 36.55,8.5 C14.1 37.03,8.02 U1.36 | v40.01,15.56 39.66,15.21 U1.45 U1.44 | U1.40 39.34,12.73 v40.01,12.07 | U1.42 40.89,13.72 v41.59,13.02 | U1.37 37.99,11.23 41.27,7.94 C13.1
  Top 1.016: C14.1 v39.05,7.59 C13.1
  Bottom 0.203: 39.05,13.34 39.37,13.02
  Bottom 0.305: v39.37,19.05 39.69,19.05 40.01,18.73 | 39.05,15.56 v40.01,15.56 | 39.05,12.07 v40.01,12.07 | 39.37,13.02 v41.59,13.02
  Bottom 1.016: JP3.2 C30.+ 52.7,37.46 52.7,31.43 40.01,18.73 39.05,17.78 39.05,15.56 39.05,13.34 39.05,12.07 v39.05,7.59
AVCCEXT
  Bottom 1.016: JP5.2 JP3.3
CSB
  Top 0.305: CON1.J4_60 6.35,8.89 10.79,8.89 12.06,7.62 12.06,6.03 12.7,5.4 12.7,3.81 13.97,2.54 32.51,2.54 35.05,5.08 U1.32
DA1_4
  Top 0.305: IC1.32 37.05,63.41 35.56,61.91 28.89,61.91 CON1.J6_26
DA1_5
  Top 0.305: IC1.31 36.55,63.86 35.24,62.55 26.99,62.55 CON1.J6_24
DA1_6
  Top 0.305: IC1.30 36.05,64.31 34.92,63.18 25.08,63.18 CON1.J6_22
DA1_7
  Top 0.305: IC1.29 35.55,64.76 34.61,63.82 23.18,63.82 CON1.J6_20
DA1_8
  Top 0.305: IC1.28 35.05,65.22 34.29,64.45 21.27,64.45 CON1.J6_18
DA1_9
  Top 0.305: IC1.27 34.55,65.67 33.97,65.09 21.27,65.09 CON1.J6_16
DA1OUT
  Top 0.305: IC1.41 56.69,71.59 58.42,69.85 58.42,57.15 60.56,55.01 R18.2 66.92,55.01 CON2.SIG
DA2_4
  Top 0.305: IC1.17 30.1,73.09 21.59,81.6 21.59,83.19 20.95,83.82 CON1.J6_2
DA2_5
  Top 0.305: IC1.18 29.65,72.59 20.95,81.28 CON1.J6_4
DA2_6
  Top 0.305: IC1.19 29.2,72.09 22.54,78.74 CON1.J6_6
DA2_7
  Top 0.305: IC1.20 28.75,71.59 24.13,76.2 CON1.J6_8
DA2_8
  Top 0.305: IC1.21 28.29,71.09 25.72,73.66 CON1.J6_10
DA2_9
  Top 0.305: IC1.22 27.84,70.59 27.3,71.12 CON1.J6_12
DA2OUT
  Top 0.305: IC1.43 58.22,72.59 R17.2 66.92,77.87 CON3.SIG
DACLK
  Top 0.305: IC1.26 34.05,66.12 33.66,65.72 23.18,65.72 CON1.J6_14
DCON
  Top 0.305: CON1.J4_34 6.35,41.91 10.79,41.91 12.06,40.64 12.06,39.05 12.7,38.42 12.7,36.83 13.34,36.2 13.34,34.61 13.97,33.97 13.97,32.38 14.61,31.75 20.83,31.75 21.59,30.99 21.59,29.21 22.86,27.94 22.86,25.4 24.64,23.62 24.64,18.35 28.26,14.73 U1.17
DCOP
  Top 0.305: CON1.J4_36 6.35,39.37 10.79,39.37 12.06,38.1 12.06,36.51 12.7,35.88 12.7,34.29 13.34,33.66 13.34,32.07 13.97,31.43 13.97,29.84 14.61,29.21 20.83,29.21 22.35,27.69 22.35,25.15 24.13,23.37 24.13,18.1 28,14.22 U1.18
FB1N
  Top 0.305: U2.23 54.1,10.43 R8.1
FB1NR
  Top 0.305: U2.24 54.59,11.7 R8.2 56.83,9.45 R14.1
FB1P
  Top 0.305: U2.2 57.2,13.21 R7.1
FB1PR
  Top 0.305: U2.1 55.54,12.73 57.39,10.87 R7.2 59.53,10.87 R11.1
FB2N
  Top 0.305: U2.5 57.74,14.73 R10.1
FB2NR
  Top 0.305: U2.6 55.85,15.21 57.07,16.43 R10.2 60.16,16.43 R13.1
FB2P
  Top 0.305: U2.8 54.1,17.73 R9.1
FB2PR
  Top 0.305: U2.7 54.59,17.83 R9.2 R12.1
GND  (via drill 0.6, 0.6 pad 1.27)
  Top 0.305: 53.09,13.72 U2.21 53.09,9.94 C26.2 | U2.22 53.59,13.72 U2.25 | 53.09,13.72 U2.16 | 53.09,13.72 U2.25 | U2.15 53.09,14.22 U2.25 | 33.97,75.09 IC1.13 | 34.61,75.09 33.97,75.09 | 35.24,75.09 34.61,75.09 | 35.56,75.09 35.24,75.09 | 35.88,75.09 35.56,75.09 | 36.51,75.09 35.88,75.09 | 36.83,75.09 36.51,75.09 | 37.47,75.09 36.83,75.09 | 38.1,75.09 37.47,75.09 | 38.73,75.09 38.1,75.09 | 39.05,75.09 38.73,75.09 | 39.05,75.09 IC1.48 38.61,75.09 38.61,74.59 | 38.35,74.59 IC1.14 | 38.35,74.59 38.61,74.59 | 38.61,74.59 IC1.47 | 34.29,74.09 IC1.15 | 38.35,74.09 34.29,74.09 | IC1.16 33.79,73.59 34.29,74.09 | 39.05,75.09 IC1.1 | IC1.2 38.55,75.27 38.73,75.09 | IC1.3 38.05,75.13 38.1,75.09 | IC1.4 37.55,75.17 37.47,75.09 | IC1.5 37.05,75.31 36.83,75.09 | IC1.6 36.55,75.12 36.51,75.09 | IC1.7 36.05,75.26 35.88,75.09 | IC1.8 35.55,75.09 35.56,75.09 | IC1.9 35.05,75.28 35.24,75.09 | IC1.10 34.55,75.14 34.61,75.09 | IC1.11 34.05,75.17 33.97,75.09 | 38.42,72.09 38.11,72.09 37.55,71.53 IC1.33 | 38.42,72.09 38.73,72.09 | 38.73,72.09 39.37,72.09 | 39.37,72.09 IC1.42 38.35,72.09 38.35,74.09 | IC1.34 38.05,71.72 38.42,72.09 | IC1.35 38.55,71.9 38.73,72.09 | IC1.36 39.05,71.77 39.37,72.09 | 38.35,74.09 IC1.46 | 38.35,74.09 38.35,74.59 | C23.2 33.05,7.68 U1.28 33.05,12.73 U1.49 34.04,14.22 U1.7 34.04,19.28 34.34,19.58
  other vias: 12.7,73.66 12.7,76.2 12.7,78.74 12.7,81.28 12.7,83.82 10.16,83.82 10.16,81.28 10.16,78.74 10.16,76.2 10.16,73.66 52.7,80.96 53.02,6.67 49.21,6.67 49.21,22.22 27.3,5.71 27.3,7.94 37.47,24.77 40.32,24.77 43.18,24.77 32.07,25.72 30.8,29.21 41.91,28.89 44.77,28.89 47.62,28.89 54.61,30.8 54.61,28.26 54.61,25.72 54.61,23.18 38.1,59.05 35.88,59.05 45.4,59.05 45.4,56.52 45.4,53.66 37.78,46.67 38.73,43.81 38.42,36.83 33.34,59.05 33.34,56.83 33.34,54.29 33.34,52.07 35.24,80.33 43.5,75.57 27.3,67.31 47.62,49.85 51.12,39.37 41.91,16.19 46.04,6.67 44.13,6.67
  pour Top (isolate 0.3): 0,87.31 80.01,87.31 80.01,0 0,0
  pour Bottom (isolate 0.3): 0,87.31 80.01,87.31 80.01,0 0,0
N$1
  Top 0.305: U1.5 35.05,18.86 35.56,19.37 R1.1
N$2  (via drill 0.6)
  Top 0.305: U1.43 41.21,14.22 v41.59,14.61
  Bottom 0.406: v41.59,14.61 42.89,14.61 C2.1 42.95,14.29 C1.1
N$3
  Top 0.305: IC1.37 42.49,69.59 42.86,69.22 42.86,66.36 43.81,65.41 C3.1
N$4
  Top 0.305: IC1.38 43.26,70.09 43.5,69.85 43.5,67.31 43.81,66.99 R2.2
N$5
  Top 0.305: IC1.39 43.72,70.59 44.13,70.17 44.13,69.22 44.77,68.58 45.37,68.58 C4.1
N$6
  Top 0.305: U2.13 48.28,15.21 45.72,17.78 R3.2
N$7
  pour Top: 50.8,53.34 61.91,53.34 61.91,44.77 50.8,44.77
N$8
  Bottom 1.016: JP4.2 JP1.3
N$9
  Top 0.305: R4.2 45.4,19.05 48.58,15.88 U2.12
N$10
  Top 0.305: U2.19 49.21,12.07 46.35,9.21 R5.2
N$11
  Top 0.305: U2.18 47.89,12.73 R6.2
N$12
  pour Top: 59.69,59.37 61.91,59.37 61.91,56.83 59.69,56.83
N$13
  pour Top: 59.69,86.04 61.59,86.04 61.59,83.5 59.69,83.5
N$14
  pour Top: 60.01,29.21 61.91,29.21 61.91,26.67 60.01,26.67
N$15
  pour Top: 59.69,5.08 61.59,5.08 61.59,2.54 59.69,2.54
N$16
  pour Top: 54.93,79.69 60.33,79.69 60.33,77.15 54.61,77.15 54.61,79.69
NOE
  Top 0.305: CON1.J4_54 6.35,16.51 10.79,16.51 12.06,15.24 12.06,13.65 12.7,13.02 12.7,11.43 13.34,10.8 13.34,9.21 13.97,8.57 13.97,6.99 14.61,6.35 24.13,6.35 26.16,4.32 32,4.32 33.53,5.84 U1.29
SCLK
  Top 0.305: CON1.J4_56 6.35,13.97 10.79,13.97 12.06,12.7 12.06,11.11 12.7,10.48 12.7,8.89 13.34,8.25 13.34,6.67 13.97,6.03 13.97,4.45 14.61,3.81 32.26,3.81 34.04,5.59 U1.30
SDIO
  Top 0.305: CON1.J4_58 6.35,11.43 10.79,11.43 12.06,10.16 12.06,8.57 12.7,7.94 12.7,6.35 13.34,5.71 13.34,4.13 14.29,3.17 32.38,3.17 34.54,5.33 U1.31
VCM  (via drill 0.6)
  Top 0.305: U1.41 40.13,13.21 41.4,11.94 45.47,11.94 46.01,12.48 C31.1 46.13,13.21 U2.17 48.7,13.21 v48.26,13.65 | U2.11 52.58,16.61 C32.1 51.4,17.11 50.8,16.51 48.9,16.51 46.99,18.41 v46.99,19.05
  Bottom 0.305: v48.26,13.65 46.67,13.65 46.04,14.29 46.04,18.1 v46.99,19.05
VINAN
  Top 0.305: U1.38 38.46,11.71 40.64,9.53 41.67,9.53 C12.1 42.47,9.21 R5.1
VINAP
  Top 0.305: U1.39 38.65,12.22 40.7,10.16 41.59,10.16 42.15,10.72 C12.2 42.47,10.48 R6.1
VINBN
  Top 0.305: U1.46 38.65,15.72 41.02,18.1 41.67,18.1 C11.1 42.47,17.78 R3.1
VINBP
  Top 0.305: U1.47 38.46,16.23 40.96,18.73 41.59,18.73 42.15,19.29 C11.2 42.47,19.05 R4.1

### Text on the board
tRestrict: 2 | DAC | 1 | ADCDAC | REV 1.1 | H.Y. | 2 | 1